# EAGLE schematic RoundESPv1 (EAGLE 7.5.0)
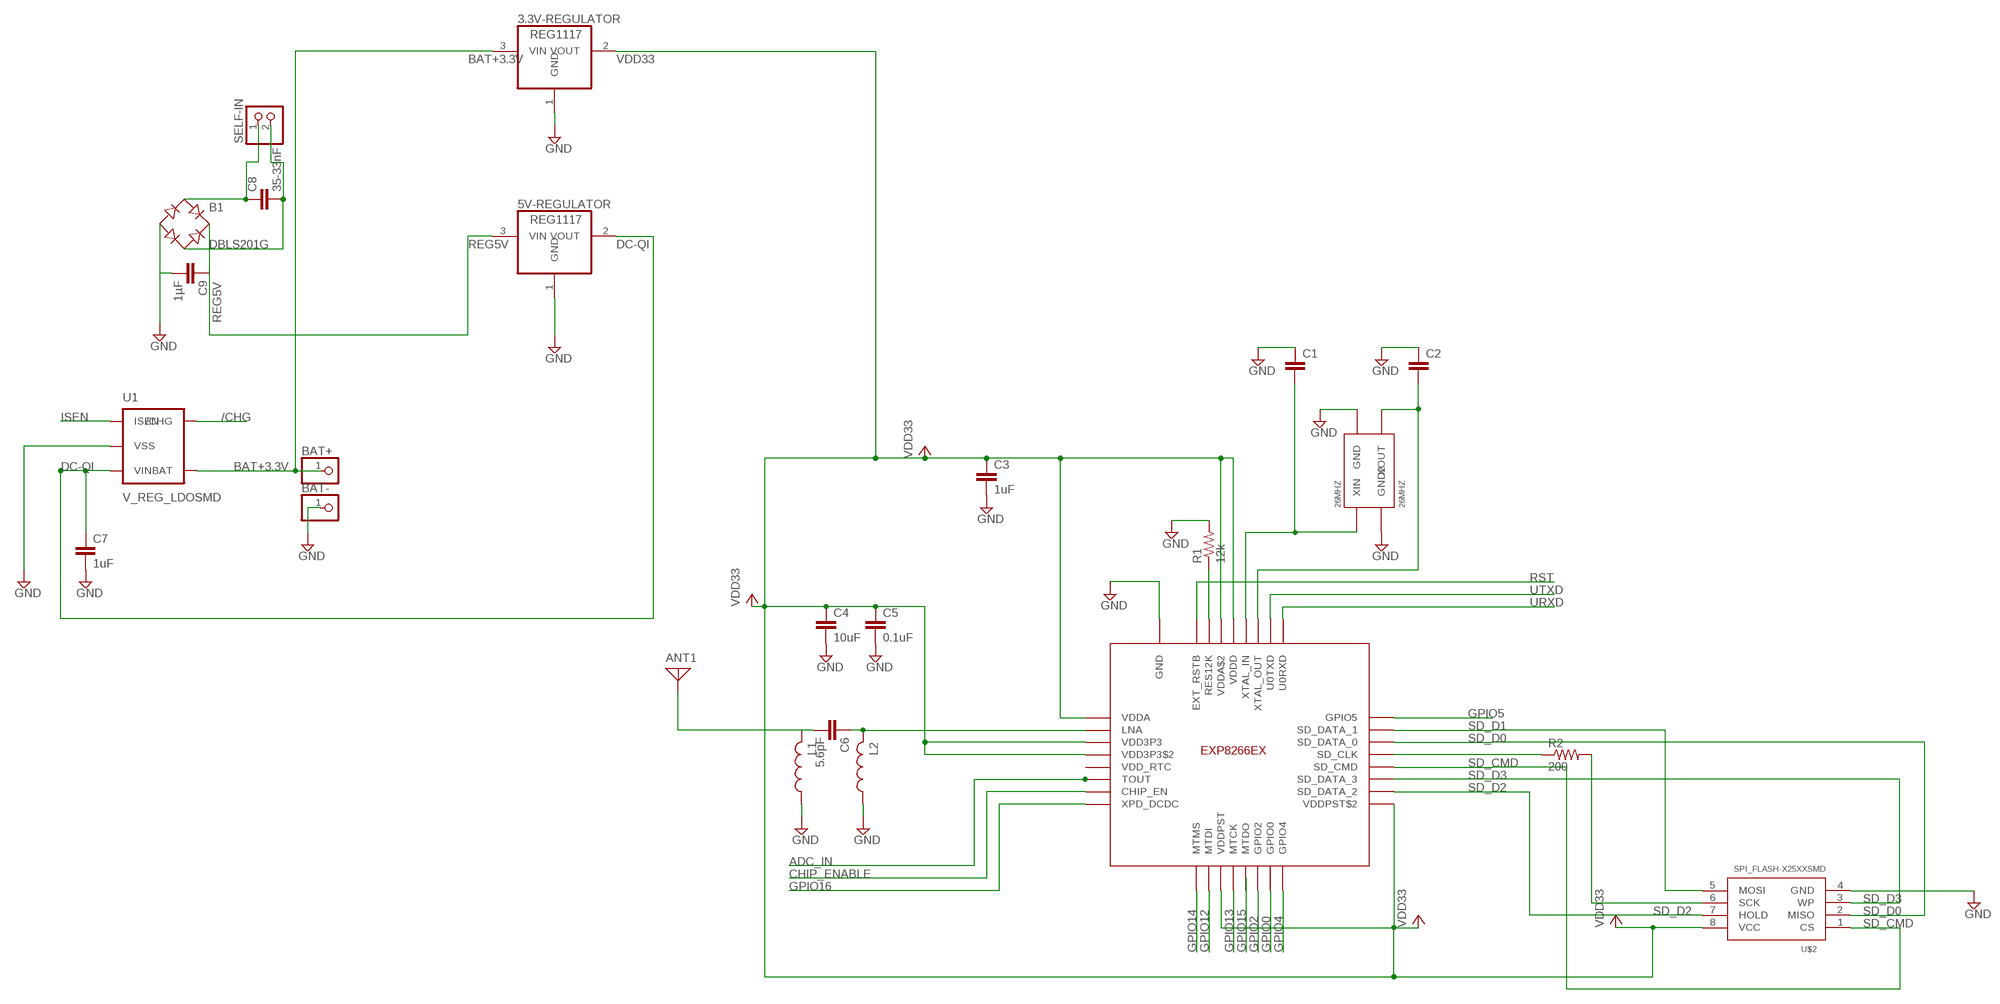
[diagram p0: schematic, sheet 1]

## Parts
3.3V-REGULATOR  REG1117  [SOT223]
5V-REGULATOR  REG1117  [SOT223]
26MHZ  26MHZ  33MHZ-OSCILLATOR  [CRYSTAL-OSC-SMD-5X3.2]
ANT1  ANTENNA  [PAD-01]
B1  DBLS201G  [DBS]
BAT+  PINHD-1X1  [1X01]
BAT-  PINHD-1X1  [1X01]
C1  C2,5-3  [C2.5-3]
C2  C2,5-3  [C2.5-3]
C3  1uF  C2,5-3  [C2.5-3]
C4  10uF  C2,5-3  [C2.5-3]
C5  0.1uF  C2,5-3  [C2.5-3]
C6  5.6pF  C2,5-3  [C2.5-3]
C7  1uF  C2,5-3  [C2.5-3]
C8  35-33nF  C2,5-3  [C2.5-3]
C9  1µF  C2,5-3  [C2.5-3]
L1  L-USL2012C  [L2012C]
L2  L-USL2012C  [L2012C]
R1  12k  R-US_M0805  [M0805]
R2  200  R-US_M0805  [M0805]
SELF-IN  PINHD-1X2  [1X02]
U1  V_REG_LDOSMD  [SOT23-5]
U2  ESP8266EX  [ESP8266EX]
U$2  SPI_FLASH-X25XXSMD  [SO08]

## Nets
/CHG: U1.5(/CHG)
ADC_IN: U2.TOUT
BAT+3.3V: 3.3V-REGULATOR.3(VIN) BAT+.1 U1.4(BAT)
CHIP_ENABLE: U2.CHIP_EN
DC-QI: 5V-REGULATOR.2(VOUT) C7.1 U1.2(VIN)
GND: 3.3V-REGULATOR.1(GND) 5V-REGULATOR.1(GND) 26MHZ.1(GND2) 26MHZ.3(GND) B1.- BAT-.1 C1.1 C2.1 C3.2 C4.2 C5.2 C7.2 C9.2 L1.1 L2.1 R1.2 U1.3(VSS) U2.GND U$2.4(GND)
GPIO0: U2.GPIO0
GPIO2: U2.GPIO2
GPIO4: U2.GPIO4
GPIO5: U2.GPOIO5(GPIO5)
GPIO12: U2.MTDI
GPIO13: U2.MTCK
GPIO14: U2.MTMS
GPIO15: U2.MTDO
GPIO16: U2.XPD_DCDC
ISEN: U1.1(ISEN)
N$1: 26MHZ.2(XOUT) C2.2 U2.XTAL_OUT
N$2: C6.1 L2.2 U2.LNA
N$3: ANT1.1 C6.2 L1.2
N$4: 26MHZ.4(XIN) C1.2 U2.XTAL_IN
N$5: R1.1 U2.RES12K
N$6: B1.AC1 C8.1 SELF-IN.1
N$7: B1.AC2 C8.2 SELF-IN.2
N$8: R2.1 U2.SD_CLK
N$9: R2.2 U$2.6(SCK)
REG5V: 5V-REGULATOR.3(VIN) B1.+ C9.1
RST: U2.EXT_RSTB
SD_CMD: U2.SD_CMD U$2.1(CS)
SD_D0: U2.SD_DATA_0 U$2.2(MISO)
SD_D1: U2.SD_DATA_1 U$2.5(MOSI)
SD_D2: U2.SD_DATA_2 U$2.7(HOLD)
SD_D3: U2.SD_DATA_3 U$2.3(WP)
URXD: U2.U0RXD
UTXD: U2.U0TXD
VDD33: 3.3V-REGULATOR.2(VOUT) C3.1 C4.1 C5.1 U2.VDD3P3 U2.VDD3P3$2 U2.VDDA U2.VDDA$2 U2.VDDD U2.VDDPST U2.VDDPST$2 U$2.8(VCC)
Unconnected: U2.VDD_RTC

## Library data of the parts
3.3V-REGULATOR 5V-REGULATOR = burr-brown:REG1117: 800mA and 1A Low Dropout (LDO) Positive Regulator 1.8V, 2.5V, 2.85V, 3.3V, 5V, and Adj; MPN: REG1117; OC_FARNELL: 1097566; OC_NEWARK: 14P6981
26MHZ = SparkFun-FreqCtrl:33MHZ-OSCILLATOR: Generic 5x3.2 Oscillator; PROD_ID: XTAL-11986
ANT1 = discrete:ANTENNA: Antenna
B1 = rectifier:DB?*G: Single Phase 1.0 AMP Glass Passivated Bridge Rectifier Taiwan Semiconductor Co.,Ltd. - TSC Source: http://www.taiwansemi.com/TSCbig5/ezcatfiles/cust/img/img/db101g.pdf http://www.ts.com.tw/db/pictures/modules/PDT/PDT060207001/DBLS201G.pdf
BAT+ BAT- = pinhead:PINHD-1X1: PIN HEADER
C1-C9 = capacitor-wima:C: CAPACITOR naming: grid - package width
L1 L2 = resistor:L-US: INDUCTOR, American symbol
R1 R2 = rcl:R-US_: RESISTOR, American symbol
SELF-IN = pinhead:PINHD-1X2: PIN HEADER
U1 = SparkFun-PowerIC:V_REG_LDO: Voltage Regulator LDO Standard 150mA LDO voltage regulator in SOT-23 layout. Micrel part MIC5205. BP (by-pass) pin is used to lower output noise with 470pF cap.
U2 = ESP8266EX:ESP8266EX
U$2 = SparkFun-DigitalIC:SPI_FLASH-X25XX: 8pin SPI Flash series x25xx. Works with devices like W25X32 and BR25L32

## Module CRYSTAL26MHZ
Ports: GND(io) XIN(io) XOUT(io) GND2(io)

### Library data of the parts